# Altium schematic sheet SimpleFOC.SchDoc
size A4; SheetNumber: 1; SheetTotal: 1
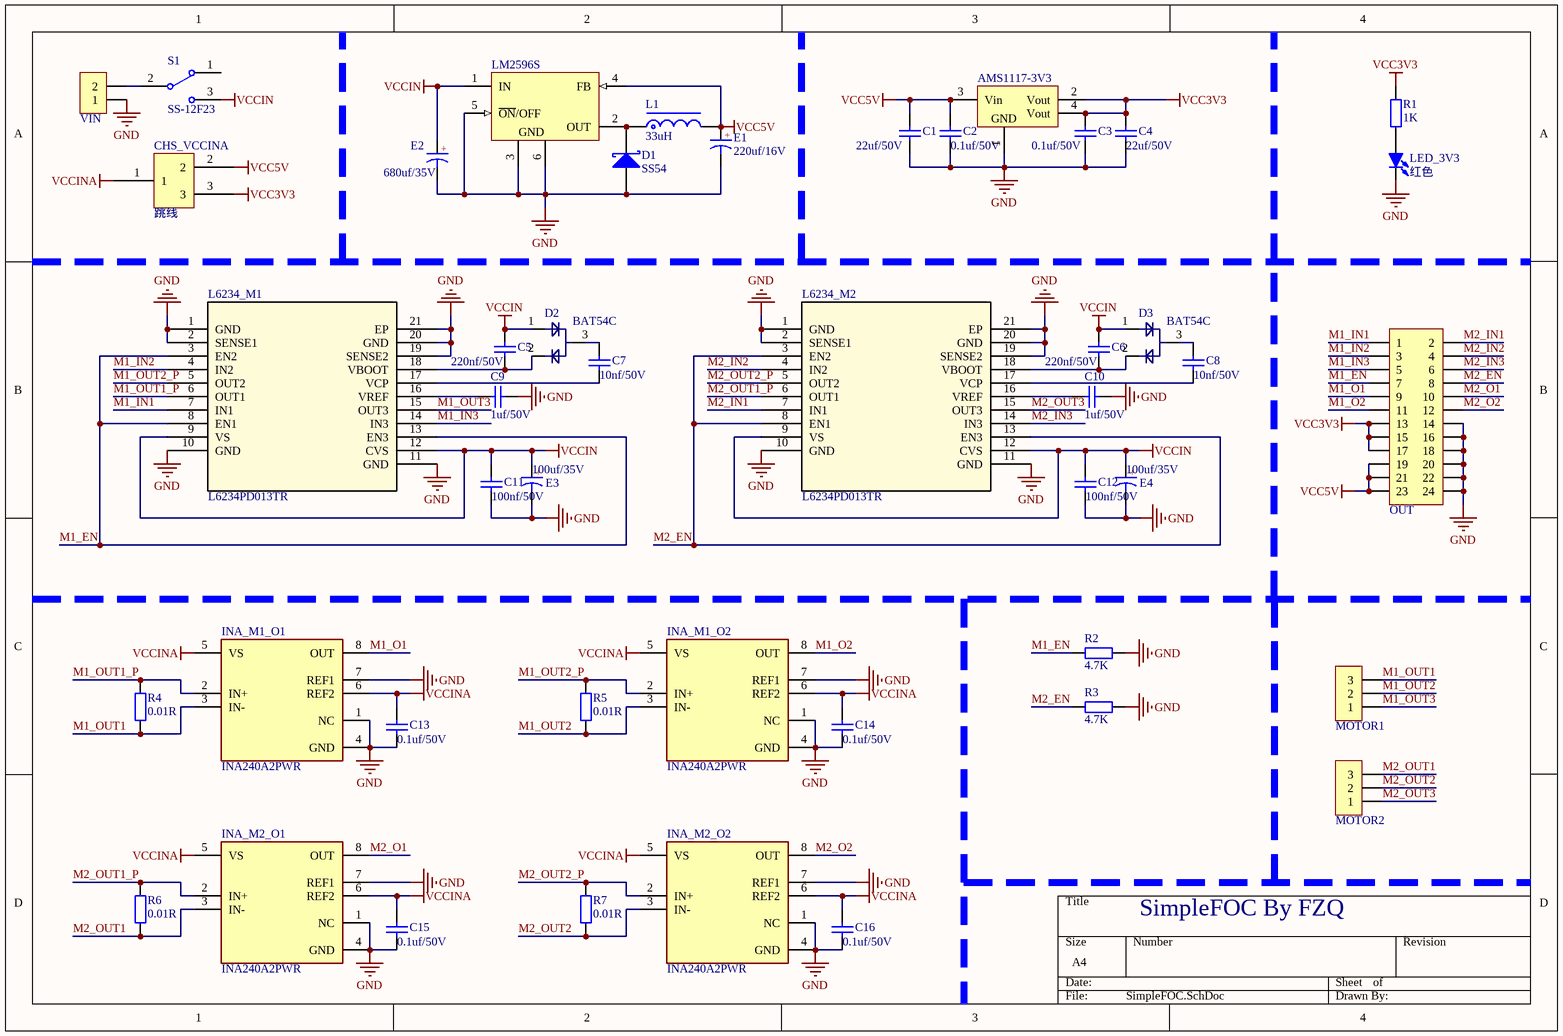
[diagram p0: SimpleFOC.SchDoc]

## Parts
AMS1117-3V3  AMS1117-3V3  [SOT223_L]  (value not drawn)
C1  22uf/50V  [C0603_L]
C2  0.1uf/50V  [C0603_L]
C3  0.1uf/50V  [C0603_L]
C4  22uf/50V  [C0603_L]
C5  220nf/50V  [C0603_L]
C6  220nf/50V  [C0603_L]
C7  10nf/50V  [C0603_L]
C8  10nf/50V  [C0603_L]
C9  1uf/50V  [C0603_L]
C10  1uf/50V  [C0603_L]
C11  100nf/50V  [C0603_L]
C12  100nf/50V  [C0603_L]
C13  0.1uf/50V  [C0603_L]
C14  0.1uf/50V  [C0603_L]
C15  0.1uf/50V  [C0603_L]
C16  0.1uf/50V  [C0603_L]
CHS_VCCINA  跳线  [0603]
D1  SS54  [SMA]
D2  BAT54C  [SOT23-3N]
D3  BAT54C  [SOT23-3N]
E1  220uf/16V  [CE D(6.3*7.7)]
E2  680uf/35V  [CE G(12.5*13.5)]
E3  100uf/35V  [CE D(6.3*7.7)]
E4  100uf/35V  [CE D(6.3*7.7)]
INA_M1_O1  INA240A2PWR  [INA240A2PWR]
INA_M1_O2  INA240A2PWR  [INA240A2PWR]
INA_M2_O1  INA240A2PWR  [INA240A2PWR]
INA_M2_O2  INA240A2PWR  [INA240A2PWR]
L1  33uH  [CDRH74]
L6234_M1  L6234PD013TR  [SOIC127P1420X360-21N]
L6234_M2  L6234PD013TR  [SOIC127P1420X360-21N]
LED_3V3  红色  [LED0603_R]
LM2596S  LM2596S  [TO263-5A]  (value not drawn)
MOTOR1  HDR-1X3  [KF301-5.0-3P]  (value not drawn)
MOTOR2  HDR-1X3  [KF301-5.0-3P]  (value not drawn)
OUT  Header 2X11  [HDR2.54-LI-2x12P]  (value not drawn)
R1  1K  [R0603_L]
R2  4.7K  [R0603_L]
R3  4.7K  [R0603_L]
R4  0.01R  [R0805_L]
R5  0.01R  [R0805_L]
R6  0.01R  [R0805_L]
R7  0.01R  [R0805_L]
S1  SS-12F23  [SS-12D10]
VIN  HDR-1X2  [KF301-5.0-2P]  (value not drawn)

## Nets
GND: AMS1117-3V3.1(GND) C1.1 C2.1 C3.1 C4.1 C9.1 C10.1 C11.1 C12.1 C13.1 C14.1 C15.1 C16.1 D1.1(A) E1.2 E2.2 E3.2 E4.2 INA_M1_O1.1(NC) INA_M1_O1.4(GND) INA_M1_O1.7(REF1) INA_M1_O2.1(NC) INA_M1_O2.4(GND) INA_M1_O2.7(REF1) INA_M2_O1.1(NC) INA_M2_O1.4(GND) INA_M2_O1.7(REF1) INA_M2_O2.1(NC) INA_M2_O2.4(GND) INA_M2_O2.7(REF1) L6234_M1.1(GND) L6234_M1.2(SENSE1) L6234_M1.10(GND) L6234_M1.11(GND) L6234_M1.19(SENSE2) L6234_M1.20(GND) L6234_M1.21(EP) L6234_M2.1(GND) L6234_M2.2(SENSE1) L6234_M2.10(GND) L6234_M2.11(GND) L6234_M2.19(SENSE2) L6234_M2.20(GND) L6234_M2.21(EP) LED_3V3.2(K) LM2596S.3(GND) LM2596S.5(~{ON}/OFF) LM2596S.6(GND) OUT.14 OUT.16 OUT.18 OUT.20 OUT.22 OUT.24 R2.2 R3.2 VIN.1
VCC3V3: AMS1117-3V3.2(Vout) AMS1117-3V3.4(Vout) C3.2 C4.2 CHS_VCCINA.3 OUT.13 OUT.15 OUT.17 R1.1
VCC5V: AMS1117-3V3.3(Vin) C1.2 C2.2 CHS_VCCINA.2 E1.1 L1.2 LM2596S.4(FB) OUT.19 OUT.21 OUT.23
VCCIN: C5.2 C6.2 C11.2 C12.2 D2.1 D3.1 E2.1 E3.1 E4.1 L6234_M1.9(VS) L6234_M1.12(CVS) L6234_M2.9(VS) L6234_M2.12(CVS) LM2596S.1(IN) S1.3
VCCINA: C13.2 C14.2 C15.2 C16.2 CHS_VCCINA.1 INA_M1_O1.5(VS) INA_M1_O1.6(REF2) INA_M1_O2.5(VS) INA_M1_O2.6(REF2) INA_M2_O1.5(VS) INA_M2_O1.6(REF2) INA_M2_O2.5(VS) INA_M2_O2.6(REF2)
M1_EN: L6234_M1.3(EN2) L6234_M1.8(EN1) L6234_M1.13(EN3) OUT.7 R2.1
M1_IN1: L6234_M1.7(IN1) OUT.1
M1_IN2: L6234_M1.4(IN2) OUT.3
M1_IN3: L6234_M1.14(IN3) OUT.5
M1_O1: INA_M1_O1.8(OUT) OUT.9
M1_O2: INA_M1_O2.8(OUT) OUT.11
M1_OUT1: INA_M1_O1.3(IN-) MOTOR1.3 R4.2
M1_OUT1_P: INA_M1_O1.2(IN+) L6234_M1.6(OUT1) R4.1
M1_OUT2: INA_M1_O2.3(IN-) MOTOR1.2 R5.2
M1_OUT2_P: INA_M1_O2.2(IN+) L6234_M1.5(OUT2) R5.1
M1_OUT3: L6234_M1.15(OUT3) MOTOR1.1
M2_EN: L6234_M2.3(EN2) L6234_M2.8(EN1) L6234_M2.13(EN3) OUT.8 R3.1
M2_IN1: L6234_M2.7(IN1) OUT.2
M2_IN2: L6234_M2.4(IN2) OUT.4
M2_IN3: L6234_M2.14(IN3) OUT.6
M2_O1: INA_M2_O1.8(OUT) OUT.10
M2_O2: INA_M2_O2.8(OUT) OUT.12
M2_OUT1: INA_M2_O1.3(IN-) MOTOR2.3 R6.2
M2_OUT1_P: INA_M2_O1.2(IN+) L6234_M2.6(OUT1) R6.1
M2_OUT2: INA_M2_O2.3(IN-) MOTOR2.2 R7.2
M2_OUT2_P: INA_M2_O2.2(IN+) L6234_M2.5(OUT2) R7.1
M2_OUT3: L6234_M2.15(OUT3) MOTOR2.1
NetC5_1: C5.1 D2.2 L6234_M1.18(VBOOT)
NetC6_1: C6.1 D3.2 L6234_M2.18(VBOOT)
NetC7_1: C7.1 L6234_M1.17(VCP)
NetC7_2: C7.2 D2.3
NetC8_1: C8.1 L6234_M2.17(VCP)
NetC8_2: C8.2 D3.3
NetC9_2: C9.2 L6234_M1.16(VREF)
NetC10_2: C10.2 L6234_M2.16(VREF)
NetD1_2: D1.2(K) L1.1 LM2596S.2(OUT)
NetLED_3V3_1: LED_3V3.1(A) R1.2
NetS1_2: S1.2 VIN.2

Not connected (* = marked no-connect by the designer): S1 1

## Notes on the sheet
- SimpleFOC By FZQ
- (in symbol CE_SMD) +

## Library data of the parts
AMS1117-3V3 = AMS1117: 三端稳压芯片; BOM名称: 稳压芯片; 封装库来自淘宝卖家 ID：黄晶宝石: 其他店铺购入均为盗版，请立即申请退款，本店现金奖励5~20元; 联系卖家 免费查找封装: 唯一出售店铺网址https://shop463601444.taobao.com
C1-C16 = C: 贴片电容; BOM名称: 无极性贴片电容; 联系卖家，免费查找封装: 唯一出售店铺网址https://shop463601444.taobao.com; 封装库来自淘宝卖家ID：黄晶宝石: 其他店铺购入均为盗版假冒封装库，请立即申请退款
D1 = SS14: 肖特基二极管(5A/40V); 属性: 40V/1A; 联系卖家，免费查找封装: 唯一出售店铺网址https://shop463601444.taobao.com; BOM名称: 肖特基二极管
D2 D3 = LBAT54SLT1G: 两路肖特基二极管; 联系卖家，免费查找封装: 唯一出售店铺网址https://shop463601444.taobao.com
E1-E4 = CE_SMD: 贴片电解电容; 联系卖家，免费查找封装: 唯一出售店铺网址https://shop463601444.taobao.com; 封装库来自淘宝卖家ID：黄晶宝石: 其他店铺购入均为盗版假冒封装库，请立即申请退款; BOM名称: 贴片电解电容
INA_M1_O1 INA_M1_O2 INA_M2_O1 INA_M2_O2 = INA240A2PWR: IC AMP CURRENT SENSE 8-TSSOP; Manufacturer: Texas Instruments; Voltage Gain: 0.05V/mV; Max Supply Voltage: 5.5V; Max Junction Temp: +150°C; Input Offset Voltage: 0.005mV; Bandwidth: 400kHz; Min Supply Voltage: 2.7V; Nominal Supply Current: 1.8mA; Standoff Height: 0.05mm; Number Of Channels: 1; Input Bias Current: 90uA; ComponentLink2URL: http://www.ti.com/lit/ds/symlink/ina240.pdf; Device Class L2: Linear ICs; ComponentLink2Description: Datasheet; Temperature: -40°C to +125°C; Octopart: https://octopart.com/ina240a2pwr-texas+instruments-75431049; Automotive: No; Manufacturer Part Number: INA240A2PWR; Ambient Temperature Range Low: -40°C; RoHS: TRUE; Package: PW0008A; Device Class L1: Integrated Circuits (ICs); Temperature Range Low: -40°C; Category: IC; Ipc Land Pattern Name: SOP65P300X120-8; Temperature Range High: +125°C; Ambient Temperature Range High: +125°C; Height: 1.2mm; Lead Free: Yes; Device Class L3: Instrumentation; Digikey Description: IC AMP CURRENT SENSE 8-TSSOP
L1 = L-CDRH: CDRH功率屏蔽电感; BOM名称: 功率屏蔽电感; 联系卖家，免费查找封装: 唯一出售店铺网址https://shop463601444.taobao.com; 封装库来自淘宝卖家ID：黄晶宝石: 其他店铺购入均为盗版假冒封装库，请立即申请退款
L6234_M1 L6234_M2 = L6234PD013TR: No Description Available; SourceLibrary: Updates_to_database_2020-11-02; Built_By: EMA_UL_Team; Vendor: STMicroelectronics; Type: DEV; Manufacturer_Part_Number: L6234PD013TR; Copyright: Copyright (C) 2021 Accelerated Designs. All rights reserved; RefDes: RefDes
LED_3V3 = LED-SMD: 贴片LED; 封装库来自淘宝卖家 ID：黄晶宝石: 其他店铺购入均为假冒，请立即申请退款，本店奖励现金5~20元; BOM名称: 贴片LED
LM2596S = LM2596S: 3A DC-DC降压芯片; BOM名称: DC降压芯片; 封装库来自淘宝卖家 ID：黄晶宝石: 其他店铺购入均为盗版，请立即申请退款，本店现金奖励5~20元; 联系卖家 免费查找封装: 唯一出售店铺网址https://shop463601444.taobao.com
MOTOR1 MOTOR2 = Header 3: 3P接插件; 联系卖家，免费技术支持: 唯一出售店铺网址https://shop463601444.taobao.com; 封装库来自淘宝卖家 ID：黄晶宝石: 其他店铺购入均为盗版假冒封装库; BOM名称: 3P接插件
OUT = Header 12X2: 12*2P接插件; 封装库来自淘宝卖家 ID：黄晶宝石: 其他店铺购入均为盗版假冒封装库; 联系卖家，免费查找封装: 唯一出售店铺网址https://shop463601444.taobao.com; BOM名称: 12*2P接插件
R1-R7 = R: 贴片电阻; 联系卖家，免费查找封装: 唯一出售店铺网址https://shop463601444.taobao.com; 封装库来自淘宝卖家ID：黄晶宝石: 其他店铺购入均为盗版假冒封装库，请立即申请退款; BOM名称: 贴片电阻
S1 = SSW-1P: 1路波动开关; BOM名称: 波动开关; 联系卖家，免费查找封装: 唯一出售店铺网址https://shop463601444.taobao.com
VIN = Header 2: 2P接插件; 联系卖家，免费技术支持: 唯一出售店铺网址https://shop463601444.taobao.com; 封装库来自淘宝卖家 ID：黄晶宝石: 其他店铺购入均为盗版假冒封装库; BOM名称: 2P接插件